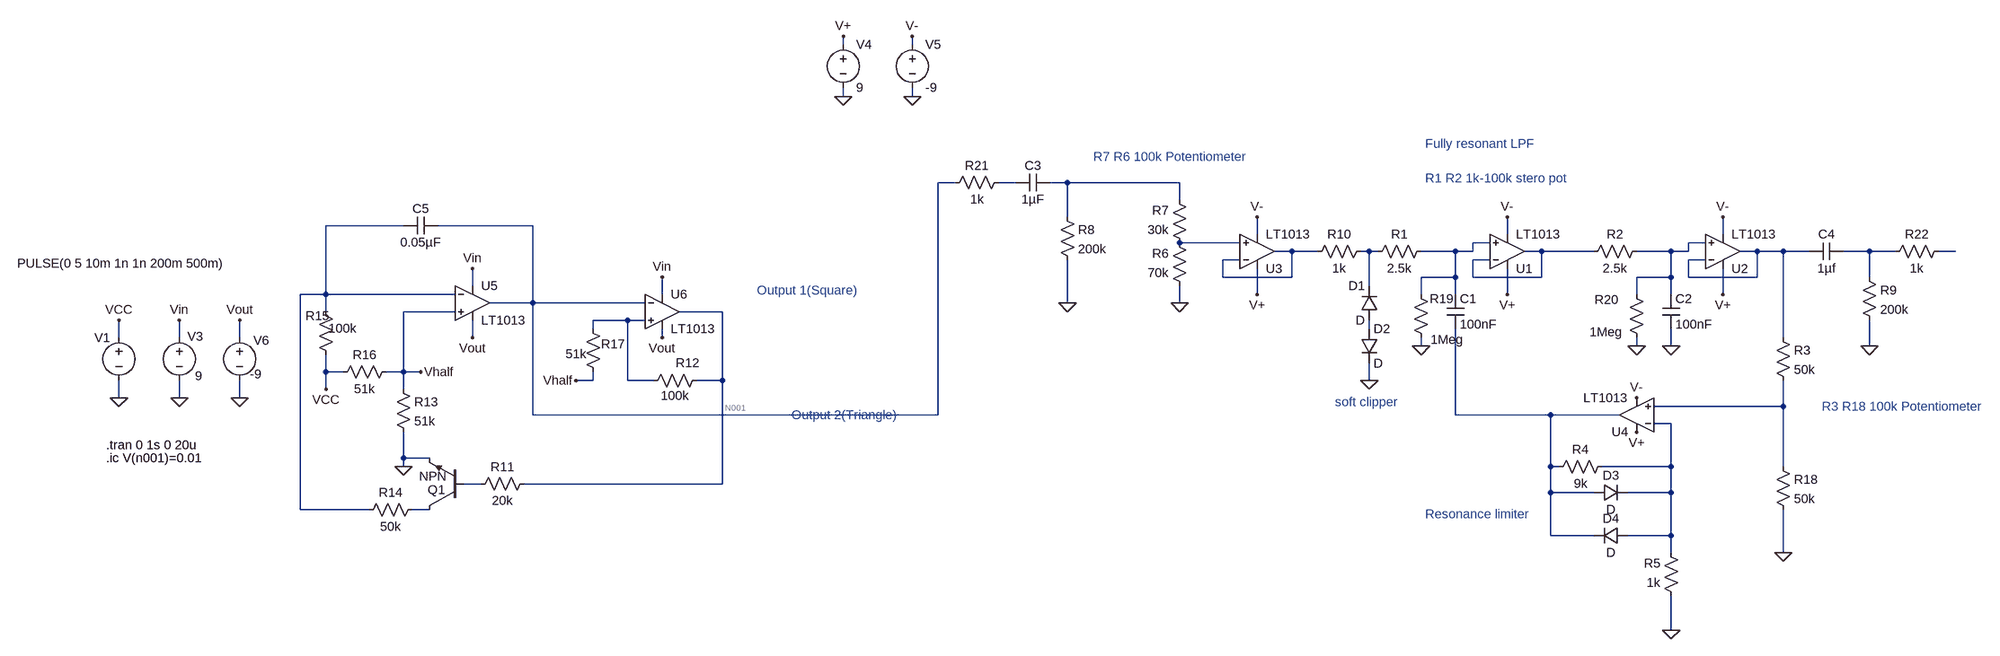
[diagram p0: schematic 260316-SynthesizerProject-VCF-V5.asc]
260316-SynthesizerProject-VCF-V5.asc, the LTspice schematic file:
Version 4.1
SHEET 1 1288 832
WIRE -1232 -512 -1232 -528
WIRE -1104 -512 -1104 -528
WIRE -1232 -416 -1232 -432
WIRE -1104 -416 -1104 -432
WIRE -1024 -256 -1056 -256
WIRE -912 -256 -944 -256
WIRE -816 -256 -848 -256
WIRE -608 -256 -816 -256
WIRE -608 -224 -608 -256
WIRE -816 -192 -816 -256
WIRE -2048 -176 -2192 -176
WIRE -1808 -176 -1984 -176
WIRE -464 -160 -464 -192
WIRE 0 -160 0 -192
WIRE 400 -160 400 -192
WIRE -496 -144 -608 -144
WIRE -32 -144 -64 -144
WIRE 368 -144 336 -144
WIRE -400 -128 -432 -128
WIRE -352 -128 -400 -128
WIRE -256 -128 -272 -128
WIRE -240 -128 -256 -128
WIRE -96 -128 -160 -128
WIRE -64 -128 -64 -144
WIRE -64 -128 -96 -128
WIRE 64 -128 32 -128
WIRE 160 -128 64 -128
WIRE 304 -128 240 -128
WIRE 336 -128 336 -144
WIRE 336 -128 304 -128
WIRE 464 -128 432 -128
WIRE 512 -128 464 -128
WIRE 560 -128 512 -128
WIRE 672 -128 624 -128
WIRE 720 -128 672 -128
WIRE 832 -128 800 -128
WIRE -496 -112 -528 -112
WIRE -32 -112 -64 -112
WIRE 368 -112 336 -112
WIRE -528 -80 -528 -112
WIRE -400 -80 -400 -128
WIRE -400 -80 -528 -80
WIRE -96 -80 -96 -128
WIRE -96 -80 -160 -80
WIRE -64 -80 -64 -112
WIRE 64 -80 64 -128
WIRE 64 -80 -64 -80
WIRE 304 -80 304 -128
WIRE 304 -80 240 -80
WIRE 336 -80 336 -112
WIRE 464 -80 464 -128
WIRE 464 -80 336 -80
WIRE 672 -80 672 -128
WIRE -1920 -64 -1920 -96
WIRE -256 -64 -256 -128
WIRE -2192 -48 -2192 -176
WIRE -2192 -48 -2240 -48
WIRE -1952 -48 -2192 -48
WIRE -1568 -48 -1568 -80
WIRE -464 -48 -464 -96
WIRE -160 -48 -160 -80
WIRE -96 -48 -96 -80
WIRE 0 -48 0 -96
WIRE 240 -48 240 -80
WIRE 304 -48 304 -80
WIRE 400 -48 400 -96
WIRE -1808 -32 -1808 -176
WIRE -1808 -32 -1888 -32
WIRE -1600 -32 -1808 -32
WIRE -816 -32 -816 -112
WIRE -608 -32 -608 -64
WIRE -2192 -16 -2192 -48
WIRE -1952 -16 -2048 -16
WIRE -1456 -16 -1536 -16
WIRE -1632 0 -1696 0
WIRE -1600 0 -1632 0
WIRE -1696 16 -1696 0
WIRE -256 16 -256 0
WIRE -2576 32 -2576 0
WIRE -2464 32 -2464 0
WIRE -2352 32 -2352 0
WIRE -1920 32 -1920 0
WIRE -1568 32 -1568 16
WIRE 512 32 512 -128
WIRE -160 48 -160 32
WIRE 240 48 240 32
WIRE 304 48 304 16
WIRE 672 48 672 0
WIRE -2192 96 -2192 64
WIRE -2160 96 -2192 96
WIRE -2048 96 -2048 -16
WIRE -2048 96 -2080 96
WIRE -2016 96 -2048 96
WIRE -1696 112 -1696 96
WIRE -1696 112 -1728 112
WIRE -1632 112 -1632 0
WIRE -1584 112 -1632 112
WIRE -1456 112 -1456 -16
WIRE -1456 112 -1504 112
WIRE -256 112 -256 80
WIRE -2192 128 -2192 96
WIRE -2048 128 -2048 96
WIRE -2576 144 -2576 112
WIRE -2464 144 -2464 112
WIRE -2352 144 -2352 112
WIRE 512 160 512 112
WIRE 512 160 272 160
WIRE -1808 176 -1808 -32
WIRE -1056 176 -1056 -256
WIRE -1056 176 -1808 176
WIRE -96 176 -96 16
WIRE 80 176 -96 176
WIRE 208 176 80 176
WIRE 304 192 272 192
WIRE -2048 256 -2048 208
WIRE -2000 256 -2048 256
WIRE -2048 272 -2048 256
WIRE 80 272 80 176
WIRE 96 272 80 272
WIRE 304 272 304 192
WIRE 304 272 176 272
WIRE 512 272 512 160
WIRE -1904 304 -1936 304
WIRE -1456 304 -1456 112
WIRE -1456 304 -1824 304
WIRE 80 320 80 272
WIRE 160 320 80 320
WIRE 304 320 304 272
WIRE 304 320 224 320
WIRE -2240 352 -2240 -48
WIRE -2112 352 -2240 352
WIRE -2000 352 -2032 352
WIRE 80 400 80 320
WIRE 160 400 80 400
WIRE 304 400 304 320
WIRE 304 400 224 400
WIRE 304 432 304 400
WIRE 512 432 512 352
WIRE 304 576 304 512
FLAG -1232 -416 0
FLAG -1104 -416 0
FLAG -1232 -528 V+
FLAG -1104 -528 V-
FLAG 304 48 0
FLAG 0 -192 V-
FLAG 0 -48 V+
FLAG 400 -48 V+
FLAG 400 -192 V-
FLAG -464 -192 V-
FLAG -464 -48 V+
FLAG 304 576 0
FLAG 512 432 0
FLAG -608 -32 0
FLAG -816 -32 0
FLAG 672 48 0
FLAG 240 208 V+
FLAG 240 144 V-
FLAG -256 112 0
FLAG -2576 144 0
FLAG -2464 144 0
FLAG -2352 144 0
FLAG -2464 0 Vin
FLAG -1920 -96 Vin
FLAG -1568 -80 Vin
FLAG -2352 0 Vout
FLAG -1920 32 Vout
FLAG -1568 32 Vout
FLAG -2016 96 Vhalf
FLAG -1728 112 Vhalf
FLAG -2576 0 VCC
FLAG -2192 128 VCC
FLAG -2048 272 0
FLAG -160 48 0
FLAG 240 48 0
SYMBOL voltage -1232 -528 R0
WINDOW 123 0 0 Left 0
WINDOW 39 0 0 Left 0
SYMATTR InstName V4
SYMATTR Value 9
SYMBOL voltage -1104 -528 R0
WINDOW 123 0 0 Left 0
WINDOW 39 0 0 Left 0
SYMATTR InstName V5
SYMATTR Value -9
SYMBOL OpAmps\\LT1013 0 -64 M180
SYMATTR InstName U1
SYMBOL OpAmps\\LT1013 400 -64 M180
SYMATTR InstName U2
SYMBOL res -144 -144 R90
WINDOW 0 0 56 VBottom 2
WINDOW 3 32 56 VTop 2
SYMATTR InstName R1
SYMATTR Value 2.5k
SYMBOL res 256 -144 R90
WINDOW 0 0 56 VBottom 2
WINDOW 3 32 56 VTop 2
SYMATTR InstName R2
SYMATTR Value 2.5k
SYMBOL cap -112 -48 R0
SYMATTR InstName C1
SYMATTR Value 100nF
SYMBOL cap 288 -48 R0
SYMATTR InstName C2
SYMATTR Value 100nF
SYMBOL OpAmps\\LT1013 -464 -64 M180
SYMATTR InstName U3
SYMBOL OpAmps\\LT1013 240 240 R180
SYMATTR InstName U4
SYMBOL res 496 16 R0
SYMATTR InstName R3
SYMATTR Value 50k
SYMBOL res 192 256 R90
WINDOW 0 0 56 VBottom 2
WINDOW 3 32 56 VTop 2
SYMATTR InstName R4
SYMATTR Value 9k
SYMBOL res 320 528 R180
WINDOW 0 36 76 Left 2
WINDOW 3 36 40 Left 2
SYMATTR InstName R5
SYMATTR Value 1k
SYMBOL res -592 -48 R180
WINDOW 0 36 76 Left 2
WINDOW 3 36 40 Left 2
SYMATTR InstName R6
SYMATTR Value 70k
SYMBOL res -592 -128 R180
WINDOW 0 36 76 Left 2
WINDOW 3 36 40 Left 2
SYMATTR InstName R7
SYMATTR Value 30k
SYMBOL res -832 -208 R0
SYMATTR InstName R8
SYMATTR Value 200k
SYMBOL cap -848 -272 R90
WINDOW 0 0 32 VBottom 2
WINDOW 3 32 32 VTop 2
SYMATTR InstName C3
SYMATTR Value 1µF
SYMBOL cap 624 -144 R90
WINDOW 0 0 32 VBottom 2
WINDOW 3 32 32 VTop 2
SYMATTR InstName C4
SYMATTR Value 1µf
SYMBOL res 656 -96 R0
SYMATTR InstName R9
SYMATTR Value 200k
SYMBOL res -256 -144 R90
WINDOW 0 0 56 VBottom 2
WINDOW 3 32 56 VTop 2
SYMATTR InstName R10
SYMATTR Value 1k
SYMBOL diode -240 0 R180
WINDOW 0 24 64 Left 2
WINDOW 3 24 0 Left 2
SYMATTR InstName D1
SYMBOL diode -272 16 R0
SYMATTR InstName D2
SYMBOL diode 160 336 R270
WINDOW 0 32 32 VTop 2
WINDOW 3 0 32 VBottom 2
SYMATTR InstName D3
SYMBOL diode 224 384 R90
WINDOW 0 0 32 VBottom 2
WINDOW 3 32 32 VTop 2
SYMATTR InstName D4
SYMBOL res -1808 288 R90
WINDOW 0 0 56 VBottom 2
WINDOW 3 32 56 VTop 2
SYMATTR InstName R11
SYMATTR Value 20k
SYMBOL res -1488 96 R90
WINDOW 0 -1 33 VBottom 2
WINDOW 3 29 56 VTop 2
SYMATTR InstName R12
SYMATTR Value 100k
SYMBOL res -2064 112 R0
SYMATTR InstName R13
SYMATTR Value 51k
SYMBOL res -2016 336 R90
WINDOW 0 0 56 VBottom 2
WINDOW 3 32 56 VTop 2
SYMATTR InstName R14
SYMATTR Value 50k
SYMBOL voltage -2576 16 R0
WINDOW 0 -16 17 Right 2
WINDOW 3 196 -122 Right 2
WINDOW 123 0 0 Left 0
WINDOW 39 0 0 Left 0
SYMATTR InstName V1
SYMATTR Value PULSE(0 5 10m 1n 1n 200m 500m)
SYMBOL cap -1984 -192 R90
WINDOW 0 0 32 VBottom 2
WINDOW 3 32 32 VTop 2
SYMATTR InstName C5
SYMATTR Value 0.05µF
SYMBOL res -2208 -32 R0
WINDOW 0 -22 24 Left 2
WINDOW 3 21 47 Left 2
SYMATTR InstName R15
SYMATTR Value 100k
SYMBOL res -2064 80 R90
WINDOW 0 0 56 VBottom 2
WINDOW 3 32 56 VTop 2
SYMATTR InstName R16
SYMATTR Value 51k
SYMBOL res -1712 0 R0
WINDOW 0 31 44 Left 2
WINDOW 3 -35 63 Left 2
SYMATTR InstName R17
SYMATTR Value 51k
SYMBOL npn -1936 352 R180
WINDOW 0 35 37 Left 2
WINDOW 3 33 62 Left 2
SYMATTR InstName Q1
SYMBOL OpAmps\\LT1013 -1920 -96 R0
SYMATTR InstName U5
SYMBOL OpAmps\\LT1013 -1568 -80 R0
SYMATTR InstName U6
SYMBOL voltage -2464 16 R0
WINDOW 0 30 -1 Top 2
WINDOW 3 36 103 Bottom 2
WINDOW 123 0 0 Left 0
WINDOW 39 0 0 Left 0
SYMATTR InstName V3
SYMATTR Value 9
SYMBOL voltage -2352 16 R0
WINDOW 0 40 6 Top 2
WINDOW 3 30 100 Bottom 2
WINDOW 123 0 0 Left 0
WINDOW 39 0 0 Left 0
SYMATTR InstName V6
SYMATTR Value -9
SYMBOL res 496 256 R0
SYMATTR InstName R18
SYMATTR Value 50k
SYMBOL res -176 -64 R0
WINDOW 0 32 24 Left 2
WINDOW 3 34 100 Left 2
SYMATTR InstName R19
SYMATTR Value 1Meg
SYMBOL res 224 -64 R0
WINDOW 0 -62 26 Left 2
WINDOW 3 -71 86 Left 2
SYMATTR InstName R20
SYMATTR Value 1Meg
SYMBOL res -928 -272 R90
WINDOW 0 0 56 VBottom 2
WINDOW 3 32 56 VTop 2
SYMATTR InstName R21
SYMATTR Value 1k
SYMBOL res 816 -144 R90
WINDOW 0 0 56 VBottom 2
WINDOW 3 32 56 VTop 2
SYMATTR InstName R22
SYMATTR Value 1k
TEXT -152 -264 Left 2 ;R1 R2 1k-100k stero pot
TEXT -768 -304 Left 2 ;R7 R6 100k Potentiometer
TEXT -152 -328 Left 2 ;Fully resonant LPF
TEXT -320 152 Left 2 ;soft clipper
TEXT -152 360 Left 2 ;Resonance limiter
TEXT -1392 -56 Left 2 ;Output 1(Square)
TEXT -1328 176 Left 2 ;Output 2(Triangle)
TEXT -2600 232 Left 2 !.tran 0 1s 0 20u
TEXT -2600 256 Left 2 !.ic V(n001)=0.01
TEXT 584 160 Left 2 ;R3 R18 100k Potentiometer

The netlist it stands for:
* 260316-SynthesizerProject-VCF-V5.asc
V4 V+ 0 9
V5 V- 0 -9
X§U1 N006 N010 V+ V- N010 LT1013  ; pins In+ In- V+ V- OUT
X§U2 N007 N011 V+ V- N011 LT1013  ; pins In+ In- V+ V- OUT
R1 N006 N009 2.5k
R2 N007 N010 2.5k
C1 N006 N018 100nF
C2 N007 0 100nF
X§U3 N005 N008 V+ V- N008 LT1013  ; pins In+ In- V+ V- OUT
X§U4 N017 N019 V+ V- N018 LT1013  ; pins In+ In- V+ V- OUT
R3 N011 N017 50k
R4 N019 N018 9k
R5 0 N019 1k
R6 0 N005 70k
R7 N005 N003 30k
R8 N003 0 200k
C3 N003 N002 1µF
C4 N012 N011 1µf
R9 N012 0 200k
R10 N009 N008 1k
D1 N016 N009 D
D2 N016 0 D
D3 N018 N019 D
D4 N019 N018 D
R11 N014 N020 20k
R12 N014 N015 100k
R13 Vhalf 0 51k
R14 N021 N004 50k
V1 VCC 0 PULSE(0 5 10m 1n 1n 200m 500m)
C5 N001 N004 0.05µF
R15 N004 VCC 100k
R16 Vhalf VCC 51k
R17 N015 Vhalf 51k
Q1 N021 N020 0 0 NPN
X§U5 Vhalf N004 Vin Vout N001 LT1013  ; pins In+ In- V+ V- OUT
X§U6 N015 N001 Vin Vout N014 LT1013  ; pins In+ In- V+ V- OUT
V3 Vin 0 9
V6 Vout 0 -9
R18 N017 0 50k
R19 N006 0 1Meg
R20 N007 0 1Meg
R21 N002 N001 1k
R22 N013 N012 1k
.model D D
.lib standard.dio
.model NPN NPN
.model PNP PNP
.lib standard.bjt
* R1 R2 1k-100k stero pot
* R7 R6 100k Potentiometer
* Fully resonant LPF
* soft clipper
* Resonance limiter
* Output 1(Square)
* Output 2(Triangle)
.tran 0 1s 0 20u
.ic V(n001)=0.01
* R3 R18 100k Potentiometer
.lib LTC.lib
.backanno
.end